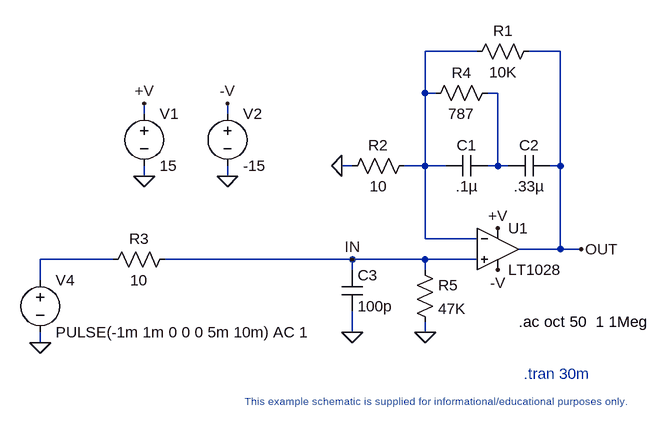
[diagram p0: schematic phono.asc]
phono.asc, the LTspice schematic file:
Version 4
SHEET 1 2060 1608
WIRE 1072 928 992 928
WIRE 1200 928 1152 928
WIRE 992 992 992 928
WIRE 1008 992 992 992
WIRE 1104 992 1088 992
WIRE 560 1024 560 1008
WIRE 688 1024 688 1008
WIRE 880 1104 864 1104
WIRE 992 1104 992 992
WIRE 992 1104 960 1104
WIRE 1024 1104 992 1104
WIRE 1104 1104 1104 992
WIRE 1104 1104 1088 1104
WIRE 1120 1104 1104 1104
WIRE 1200 1104 1200 928
WIRE 1200 1104 1184 1104
WIRE 560 1120 560 1104
WIRE 688 1120 688 1104
WIRE 992 1216 992 1104
WIRE 1072 1216 992 1216
WIRE 1200 1232 1200 1104
WIRE 1200 1232 1136 1232
WIRE 1232 1232 1200 1232
WIRE 512 1248 400 1248
WIRE 880 1248 592 1248
WIRE 992 1248 880 1248
WIRE 1072 1248 992 1248
WIRE 880 1264 880 1248
WIRE 992 1264 992 1248
WIRE 400 1280 400 1248
WIRE 880 1360 880 1328
WIRE 992 1360 992 1344
WIRE 400 1376 400 1360
FLAG 560 1120 0
FLAG 688 1120 0
FLAG 400 1376 0
FLAG 864 1104 0
FLAG 992 1360 0
FLAG 880 1360 0
FLAG 880 1248 IN
FLAG 1232 1232 OUT
FLAG 560 1008 +V
FLAG 1104 1200 +V
FLAG 1104 1264 -V
FLAG 688 1008 -V
SYMBOL cap 1088 1088 R90
WINDOW 0 0 32 VBottom 2
WINDOW 3 32 32 VTop 2
SYMATTR InstName C1
SYMATTR Value .1µ
SYMBOL cap 1184 1088 R90
WINDOW 0 0 32 VBottom 2
WINDOW 3 32 32 VTop 2
SYMATTR InstName C2
SYMATTR Value .33µ
SYMBOL res 1168 912 R90
WINDOW 0 0 56 VBottom 2
WINDOW 3 32 56 VTop 2
SYMATTR InstName R1
SYMATTR Value 10K
SYMBOL res 976 1088 R90
WINDOW 0 0 56 VBottom 2
WINDOW 3 32 56 VTop 2
SYMATTR InstName R2
SYMATTR Value 10
SYMBOL res 608 1232 R90
WINDOW 0 0 56 VBottom 2
WINDOW 3 32 56 VTop 2
SYMATTR InstName R3
SYMATTR Value 10
SYMBOL res 1104 976 R90
WINDOW 0 0 56 VBottom 2
WINDOW 3 32 56 VTop 2
SYMATTR InstName R4
SYMATTR Value 787
SYMBOL cap 864 1264 R0
SYMATTR InstName C3
SYMATTR Value 100p
SYMBOL res 976 1248 R0
SYMATTR InstName R5
SYMATTR Value 47K
SYMBOL voltage 560 1008 R0
SYMATTR InstName V1
SYMATTR Value 15
SYMBOL voltage 688 1008 R0
SYMATTR InstName V2
SYMATTR Value -15
SYMBOL voltage 400 1264 R0
SYMATTR InstName V4
SYMATTR Value PULSE(-1m 1m 0 0 0 5m 10m) AC 1
SYMBOL OPAMPS\\LT1028 1104 1168 R0
SYMATTR InstName U1
TEXT 1144 1424 Left 2 ;.tran 30m
TEXT 1136 1344 Left 2 !.ac oct 50  1 1Meg
TEXT 1000 1456 Top 1 ;This example schematic is supplied for informational/educational purposes only.

The netlist it stands for:
* phono.asc
C1 N002 N001 .1µ
C2 OUT N002 .33µ
R1 OUT N001 10K
R2 N001 0 10
R3 IN N003 10
R4 N002 N001 787
C3 IN 0 100p
R5 IN 0 47K
V1 +V 0 15
V2 -V 0 -15
V4 N003 0 PULSE(-1m 1m 0 0 0 5m 10m) AC 1
XU1 IN N001 +V -V OUT LT1028  ; pins In+ In- V+ V- OUT
* .tran 30m
.ac oct 50  1 1Meg
* This example schematic is supplied for informational/educational purposes only.
.lib LTC.lib
.backanno
.end